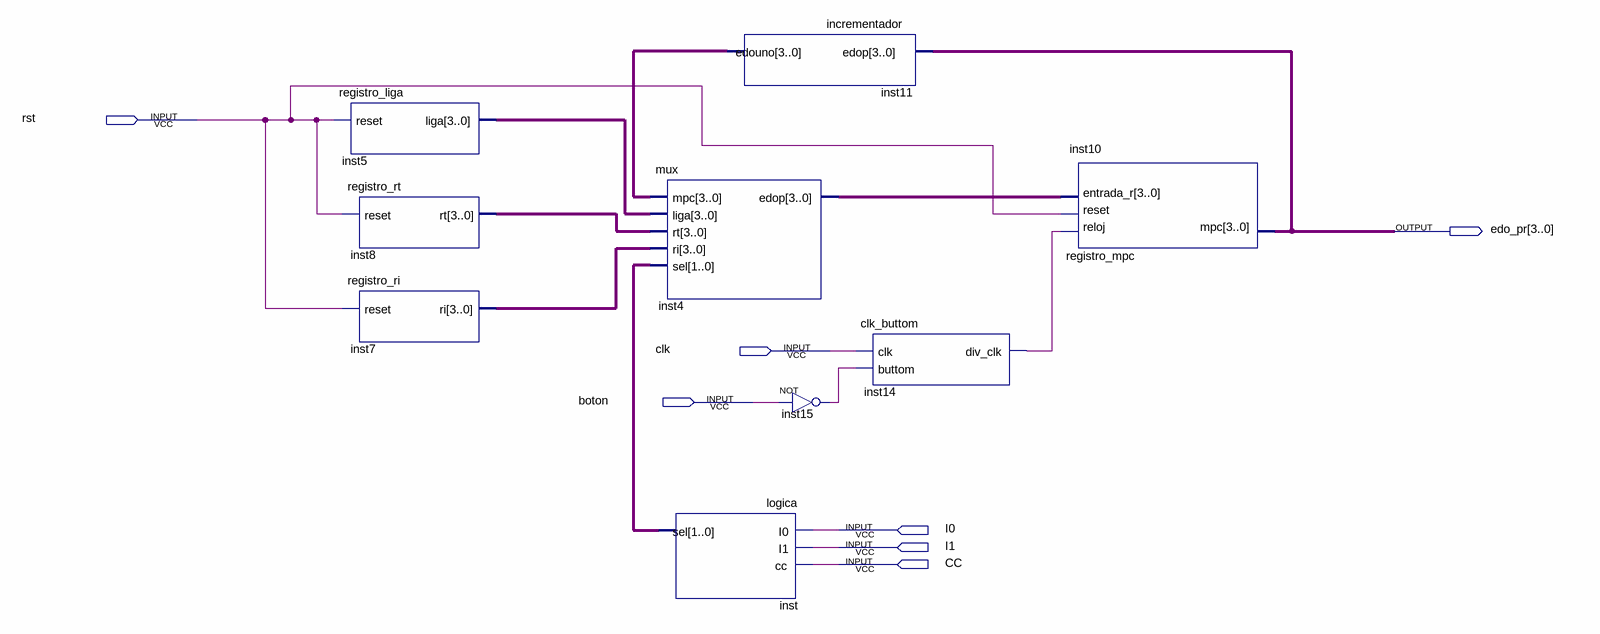
[diagram p0: schematic sheet]
// Quartus schematic practica6.bdf as structural Verilog: 9 symbols, 7 pins
module practica6 (
  input  rst,
  input  clk,
  input  boton,
  input  I0,
  input  I1,
  input  CC,
  output [3:0] edo_pr
);

  wire inst14_div_clk, inst15_out;
  wire [1:0] inst_sel;
  wire [3:0] inst4_edop, inst5_liga, inst7_ri, inst8_rt, inst11_edouno;

  registro_liga inst5 (.reset(rst), .liga(inst5_liga));
  registro_rt inst8 (.reset(rst), .rt(inst8_rt));
  registro_ri inst7 (.reset(rst), .ri(inst7_ri));
  mux inst4 (.mpc(inst11_edouno), .liga(inst5_liga), .rt(inst8_rt), .ri(inst7_ri), .sel(inst_sel), .edop(inst4_edop));
  logica inst (.I0(I0), .I1(I1), .cc(CC), .sel(inst_sel));
  incrementador inst11 (.edop(edo_pr), .edouno(inst11_edouno));
  not inst15 (inst15_out, boton);
  clk_buttom inst14 (.clk(clk), .buttom(inst15_out), .div_clk(inst14_div_clk));
  registro_mpc inst10 (.reloj(inst14_div_clk), .reset(rst), .entrada_r(inst4_edop), .mpc(edo_pr));
endmodule
